# EAGLE design ladybug (EAGLE 9.1.1)
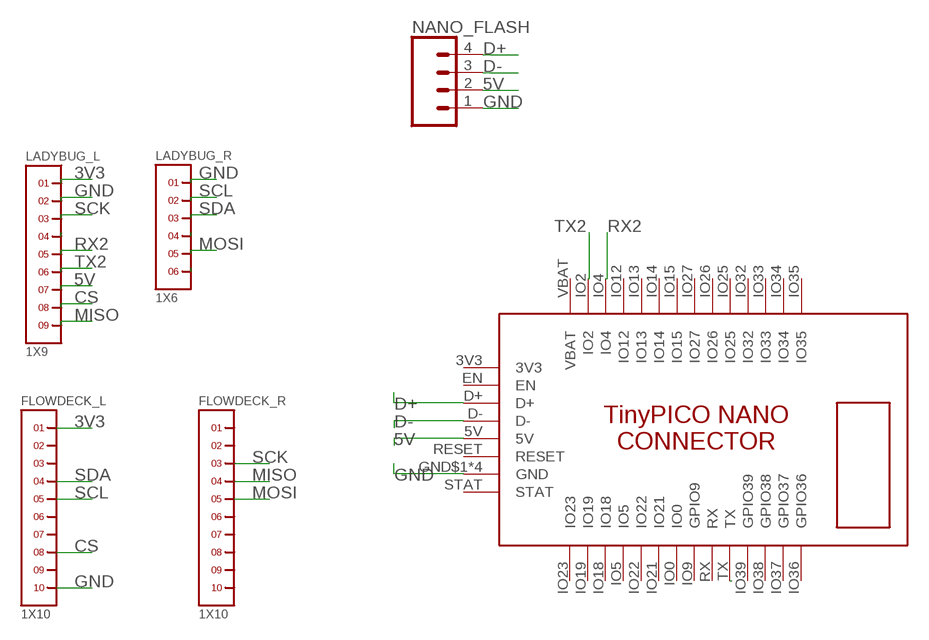
[diagram p0: schematic, sheet 1]

## Parts
FLOWDECK_L  1X10  [1X10]
FLOWDECK_R  1X10  [1X10]
LADYBUG_L  1X9  [1X9]
LADYBUG_R  1X6  [1X6]
NANO_FLASH  CONN_041X04_NO_SILK  [1X04_NO_SILK]
U$1  TINYPICO-NANO-CONNECTOR  [TINYPICO-NANO-CONNECTOR]

## Nets
3V3: FLOWDECK_L.1 LADYBUG_L.1
5V: LADYBUG_L.7 NANO_FLASH.2 U$1.5V
A0: LADYBUG_R.4
CS: FLOWDECK_L.8 LADYBUG_L.8
D+: NANO_FLASH.4 U$1.D+
D-: NANO_FLASH.3 U$1.D-
GND: FLOWDECK_L.10 LADYBUG_L.2 LADYBUG_R.1 NANO_FLASH.1 U$1.GND$1(GND) U$1.GND$2(GND) U$1.GND$3(GND) U$1.GND$4(GND)
LED: LADYBUG_L.4
MISO: FLOWDECK_R.4 LADYBUG_L.9
MOSI: FLOWDECK_R.5 LADYBUG_R.5
RX: U$1.TX
RX2: LADYBUG_L.5 U$1.IO4
SCK: FLOWDECK_R.3 LADYBUG_L.3
SCL: FLOWDECK_L.5 LADYBUG_R.2
SDA: FLOWDECK_L.4 LADYBUG_R.3
TX1: LADYBUG_R.6
TX2: LADYBUG_L.6 U$1.IO2
Unconnected: FLOWDECK_L.2 FLOWDECK_L.3 FLOWDECK_L.6 FLOWDECK_L.7 FLOWDECK_L.9 FLOWDECK_R.1 FLOWDECK_R.2 FLOWDECK_R.6 FLOWDECK_R.7 FLOWDECK_R.8 FLOWDECK_R.9 FLOWDECK_R.10 U$1.EN U$1.IO0 U$1.IO5 U$1.IO9(GPIO9) U$1.IO12 U$1.IO13 U$1.IO14 U$1.IO15 U$1.IO18 U$1.IO19 U$1.IO21 U$1.IO22 U$1.IO23 U$1.IO25 U$1.IO26 U$1.IO27 U$1.IO32 U$1.IO33 U$1.IO34 U$1.IO35 U$1.IO36(GPIO36) U$1.IO37(GPIO37) U$1.IO38(GPIO38) U$1.IO39(GPIO39) U$1.RESET U$1.RX U$1.STAT

## Power pins joined to a net without a drawn wire
3V3: U$1.3V3
VBAT: U$1.VBAT

## Library data of the parts
FLOWDECK_L FLOWDECK_R = headers(2mm):1X10
LADYBUG_L = headers(2mm):1X9
LADYBUG_R = headers(2mm):1X6
NANO_FLASH = SparkFun-Connectors:CONN_04: Multi connection point. Often used as Generic Header-pin footprint for 0.1 inch spaced/style header connections On any of the 0.1 inch spaced packages, you can populate with these: Break Away Headers - Straight <https://www.sparkfun.com/products/116> (PRT-00116) Break Away Male Headers - Right Angle <https://www.sparkfun.com/products/553> (PRT-00553) Female Headers <https://www.sparkfun.com/products/115> (PRT-00115) Break Away Headers - Machine Pin <https://www.sparkfun.com/products/117> (PRT-00117) Break Away Female Headers - Swiss Machine Pin <https://www.sparkfun.com/products/743> (PRT-00743) For SCREWTERMINALS and SPRING TERMINALS visit here: Screw Terimnals on SparkFun.com <https://www.sparkfun.com/search/results?term=Screw+Terminals> (5mm/3.5mm/2.54mm spacing) This device is also useful as a general connection point to wire up your design to another part of your project. Our various solder wires solder well into these plated through hole pads. Hook-Up Wire - Assortment (Stranded, 22 AWG) <https://www.sparkfun.com/products/11375> (PRT-11375) Hook-Up Wire - Assortment (Solid Core, 22 AWG) <https://www.sparkfun.com/products/11367> (PRT-11367) View the entire wire category on our website here <https://www.sparkfun.com/categories/141> Special notes: Molex polarized connector foot print use with SKU : PRT-08231 with associated crimp pins and housings. 1MM SMD Version SKU: PRT-10208; PROD_ID: CONN-09696
U$1 = TinyPICO_NANO_Eagle:TINYPICO-NANO-CONNECTOR: TinyPICO NANO Footprint https://www.tinypico.com/tinypico-nano

## Board
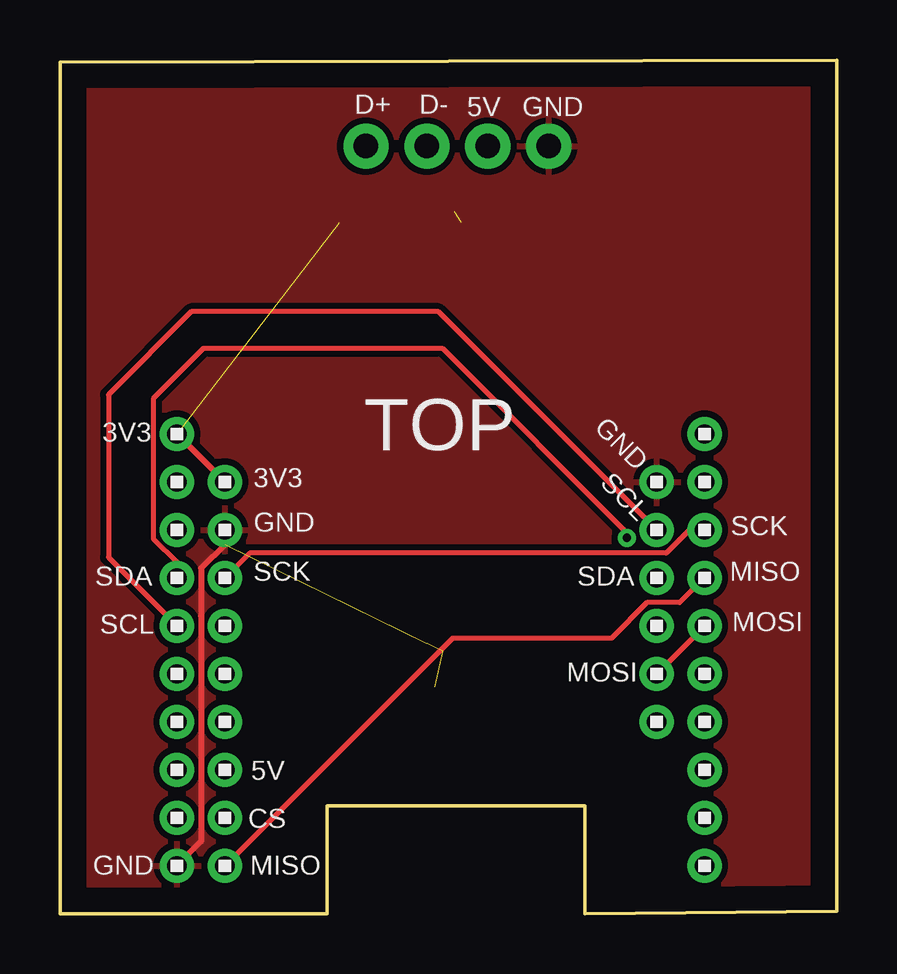
[diagram p1: board, top side]
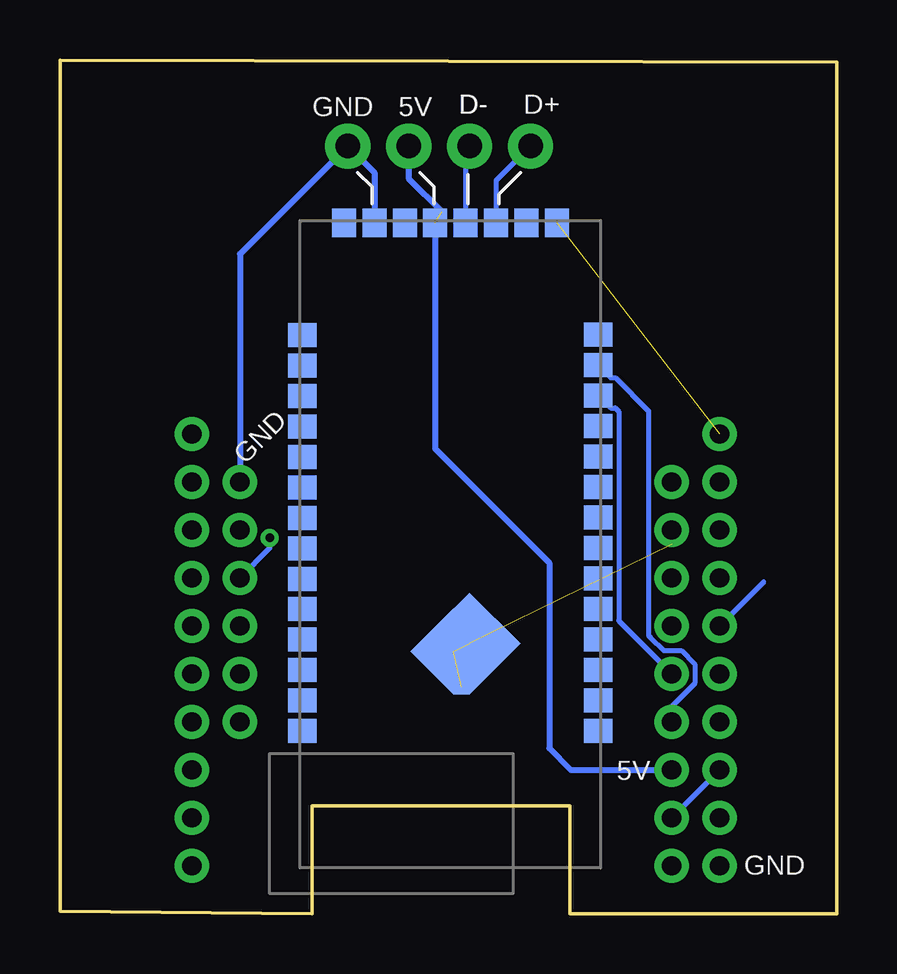
[diagram p2: board, bottom side, seen from below]

Size 32.38 x 35.59 mm. Coordinates in mm from the lower left corner, seen from the top.
Outline: 0,0 0,35.49 32.38,35.59 32.38,0.1 21.88,0 21.88,4.5 11.13,4.5 11.13,0 0,0
Copper layers (1*16): Top 0.035mm / dielectric 1.5mm / Bottom 0.035mm
Design rules "default": minimum track width 6mil, minimum drill 0.35mm, track to track 6mil, track to pad 6mil, pad to pad 6mil, via to via 6mil, smd to smd 6mil, copper to edge 40mil, drill to drill 6mil, minimum pad ring 10mil, minimum via ring 8mil, stop-mask expansion 4mil, vias tented up to drill 0mil, thermal gap 10mil

### Footprints (pad centres in the part's own frame; a part is rotated, then mirrored left to right if it is on the bottom)
1X10 = drill 0.8 pad 1.422: 1 -9,0; 2 -7,0; 3 -5,0; 4 -3,0; 5 -1,0; 6 1,0; 7 3,0; 8 5,0; 9 7,0; 10 9,0
1X9 = drill 0.8 pad 1.422: 1 -8,0; 2 -6,0; 3 -4,0; 4 -2,0; 5 0,0; 6 2,0; 7 4,0; 8 6,0; 9 8,0
1X6 = drill 0.8 pad 1.422: 1 -5,0; 2 -3,0; 3 -1,0; 4 1,0; 5 3,0; 6 5,0
1X04_NO_SILK = drill 1.016 pad 1.88: 1 0,0; 2 2.54,0; 3 5.08,0; 4 7.62,0
TINYPICO-NANO-CONNECTOR = smd 1.2 x 1: 3V3 0.1,10.725; 5V 0.1,5.645; D+ 0.1,8.185; D- 0.1,6.915; EN 0.1,9.455; GND$1 0.1,3.105; RESET 0.1,4.375; STAT 0.1,1.835 | smd 3 x 3 rotated 45: GND$2 17.643,7.082 | smd 0.66 x 0.671: GND$3 19.436,6.746 | smd 2.54 x 2.54 rotated 45: GND$4 17.971,6.413 | smd 1 x 1.2: IO0 12.395,0.1; IO2 6.034,12.44; IO4 7.304,12.44; IO5 8.585,0.1; IO9 13.665,0.1; IO12 8.574,12.44; IO13 9.844,12.44; IO14 11.114,12.44; IO15 12.384,12.44; IO18 7.315,0.1; IO19 6.045,0.1; IO21 11.125,0.1; IO22 9.855,0.1; IO23 4.775,0.1; IO25 16.194,12.44; IO26 14.924,12.44; IO27 13.654,12.44; IO32 17.464,12.44; IO33 18.734,12.44; IO34 20.004,12.44; IO35 21.274,12.44; IO36 21.285,0.1; IO37 20.015,0.1; IO38 18.745,0.1; IO39 17.475,0.1; RX 14.935,0.1; TX 16.205,0.1; VBAT 4.764,12.44

### Placement (x,y rotation side)
FLOWDECK_L  4.88,11 270 top
FLOWDECK_R  26.88,11 270 top
LADYBUG_L  6.88,10 270 top
LADYBUG_R  24.88,13 270 top
NANO_FLASH  20.38,32 180 top
U$1  22.38,28.9 270 bottom

### Tracks (layer width: path | path; a pad name or v marks a point on that pad's centre or on a via)
3V3  (1 unrouted)
  Top 0.254: FLOWDECK_L.1 LADYBUG_L.1
5V  (1 unrouted)
  Bottom 0.254: NANO_FLASH.2 17.84,30.65 16.45,29.26 | U$1.5V 16.73,19.38 11.98,14.63 11.98,6.91 11.06,5.99 LADYBUG_L.7
CS
  Bottom 0.203: FLOWDECK_L.8 LADYBUG_L.8
D+
  Bottom 0.203: NANO_FLASH.4 14.19,30.57 U$1.D+
D-
  Bottom 0.203: NANO_FLASH.3 15.46,31.84 U$1.D-
GND  (3 unrouted)
  Top 0.254: LADYBUG_L.2 6.88,15.4 5.88,14.41 5.88,12.4 5.88,12.39 5.88,3.01 FLOWDECK_L.10
  Bottom 0.254: U$1.GND$1 19.27,30.89 NANO_FLASH.1 24.88,27.5 LADYBUG_R.1
  pour Top (isolate 0.254): 0.02,35.56 32.67,35.56 32.67,-0.88 22.28,-0.88 22.28,4.95 11.1,4.95 11.1,-0.63 0.02,-0.63
MISO
  Top 0.203: FLOWDECK_R.4 25.84,12.96 24.48,12.96 22.99,11.48 16.36,11.48 LADYBUG_L.9
MOSI
  Top 0.203: FLOWDECK_R.5 LADYBUG_R.5
RX2
  Bottom 0.203: LADYBUG_L.5 9.08,12.21 9.08,20.93 9.23,21.08 9.42,21.08 U$1.IO4
SCK
  Top 0.203: LADYBUG_L.3 7.91,15.04 25.28,15.04 26.24,16 FLOWDECK_R.3
SCL
  Top 0.203: LADYBUG_R.2 15.78,25.09 5.48,25.09 2.02,21.64 2.02,14.85 FLOWDECK_L.5
  Bottom 0.203: 3.04,13.84 FLOWDECK_L.5
SDA  (via drill 0.35)
  Top 0.203: FLOWDECK_L.4 4.88,14.63 3.91,15.6 3.91,21.5 5.98,23.57 15.94,23.57 23.85,15.67 v23.64,15.67 | 23.66,15.65 v23.64,15.67 | v23.64,15.67 v23.63,15.67
  Bottom 0.203: v23.63,15.67 23.63,15.24 LADYBUG_R.3
TX2
  Bottom 0.203: U$1.IO2 9.42,22.35 9.23,22.35 7.84,20.96 7.84,11.6 7.77,11.53 7.21,10.96 6.48,10.96 5.91,10.4 5.91,9.6 6.88,8.63 LADYBUG_L.6

### Text on the board
tPlace: D+ | D- | 5V | GND | 3V3 | GND | 3V3 | SCL | GND | SCK | SDA | SCK | SDA | MISO | SCL | MOSI | MOSI | 5V | CS | GND | MISO
bPlace: D+ | D- | D- | 5V | GND | GND | 5V | GND
tNames: TOP